# EAGLE design PCB-SSB-2x1 (EAGLE 7.5.0)
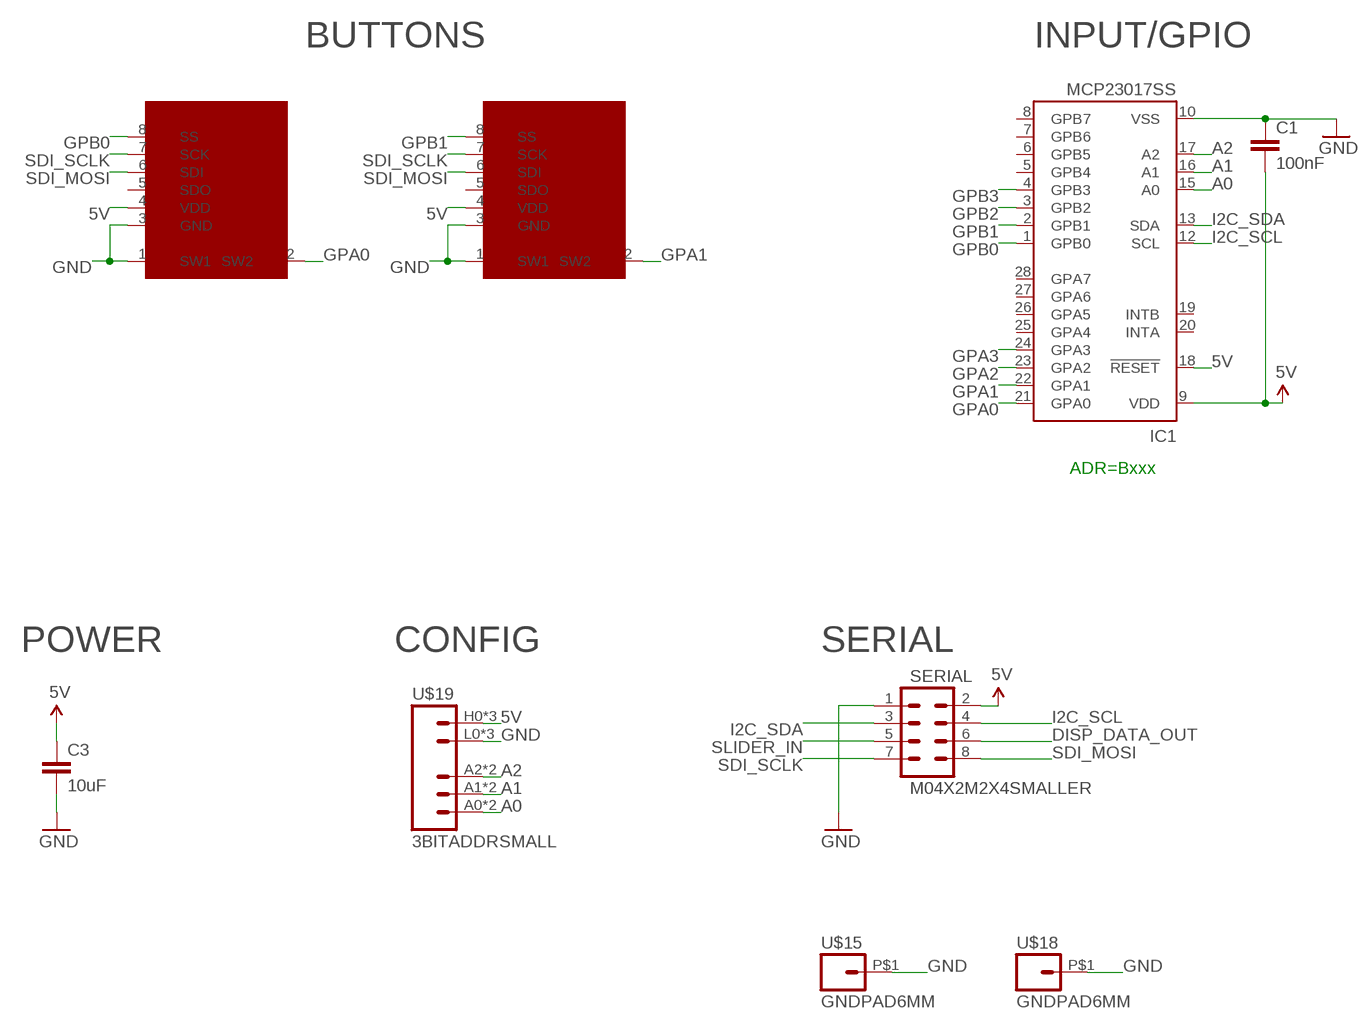
[diagram p0: schematic, sheet 1]

## Parts
C1  100nF  CAP0603-CAP  [0603-CAP]
C3  10uF  CAP0805  [0805]
IC1  MCP23017SS  [SSOP28]
SERIAL  M04X2M2X4SMALLER  [M2X4SMALLER]
SSW1  SMART_SWITCHSMART_SWITCH_8PIN  [SMART_SWITCH]
SSW2  SMART_SWITCHSMART_SWITCH_8PIN  [SMART_SWITCH]
U$15  GNDPAD6MM  [3.2MMPAD6MM]
U$18  GNDPAD6MM  [3.2MMPAD6MM]
U$19  3BITADDRSMALL  [3BITADDR_SMALL]

## Nets
5V [Power]: C1.2 C3.1 IC1.9(VDD) IC1.18(!RESET) SERIAL.2 SSW1.4(VDD) SSW2.4(VDD) U$19.H0(VCC) U$19.H1(VCC) U$19.H2(VCC)
A0: IC1.15(A0) U$19.A0 U$19.AS0(A0)
A1: IC1.16(A1) U$19.A1 U$19.AS1(A1)
A2: IC1.17(A2) U$19.A2 U$19.AS2(A2)
DISP_DATA_OUT: SERIAL.6
GND [Power]: C1.1 C3.2 IC1.10(VSS) SERIAL.1 SSW1.1(SW1) SSW1.3(GND) SSW2.1(SW1) SSW2.3(GND) U$15.P$1 U$18.P$1 U$19.L0(GND) U$19.L1(GND) U$19.L2(GND)
GPA0: IC1.21(GPA0) SSW1.2(SW2)
GPA1: IC1.22(GPA1) SSW2.2(SW2)
GPA2: IC1.23(GPA2)
GPA3: IC1.24(GPA3)
GPB0: IC1.1(GPB0) SSW1.8(SS)
GPB1: IC1.2(GPB1) SSW2.8(SS)
GPB2: IC1.3(GPB2)
GPB3: IC1.4(GPB3)
I2C_SCL: IC1.12(SCL) SERIAL.4
I2C_SDA: IC1.13(SDA) SERIAL.3
SDI_MOSI: SERIAL.8 SSW1.6(SDI) SSW2.6(SDI)
SDI_SCLK: SERIAL.7 SSW1.7(SCK) SSW2.7(SCK)
SLIDER_IN: SERIAL.5
Unconnected: IC1.5(GPB4) IC1.6(GPB5) IC1.7(GPB6) IC1.8(GPB7) IC1.19(INTB) IC1.20(INTA) IC1.25(GPA4) IC1.26(GPA5) IC1.27(GPA6) IC1.28(GPA7) SSW1.5(SDO) SSW2.5(SDO)

## Notes on the sheet
- BUTTONS | INPUT/GPIO
- ADR=Bxxx
- POWER | CONFIG | SERIAL

## Library data of the parts
C1 C3 = SparkFun:CAP: Capacitor Standard 0603 ceramic capacitor, and 0.1" leaded capacitor.
IC1 = microchip:MCP23017: http://ww1.microchip.com/downloads/en/DeviceDoc/21952a.pdf Source: http://ww1.microchip.com/downloads/en/DeviceDoc/21952a.pdf; MF: MICROCHIP; MPN: MCP23017-E/SS; OC_FARNELL: 1467674; OC_NEWARK: 31K2960
SERIAL = SKAARHOJ:M04X2
SSW1 SSW2 = SKAARHOJ:SMART_SWITCH: SMARTSWITCH IS15DSBFP4RGB www.nkksmartswitch.com
U$15 U$18 = SKAARHOJ:GNDPAD
U$19 = SKAARHOJ:3BITADDR

## Net classes
0 default: width 0.203 mm, drill 0.406 mm, clearance 0.203 mm
1 Power: width 0.406 mm, drill 0.61 mm, clearance 0.203 mm

## Board
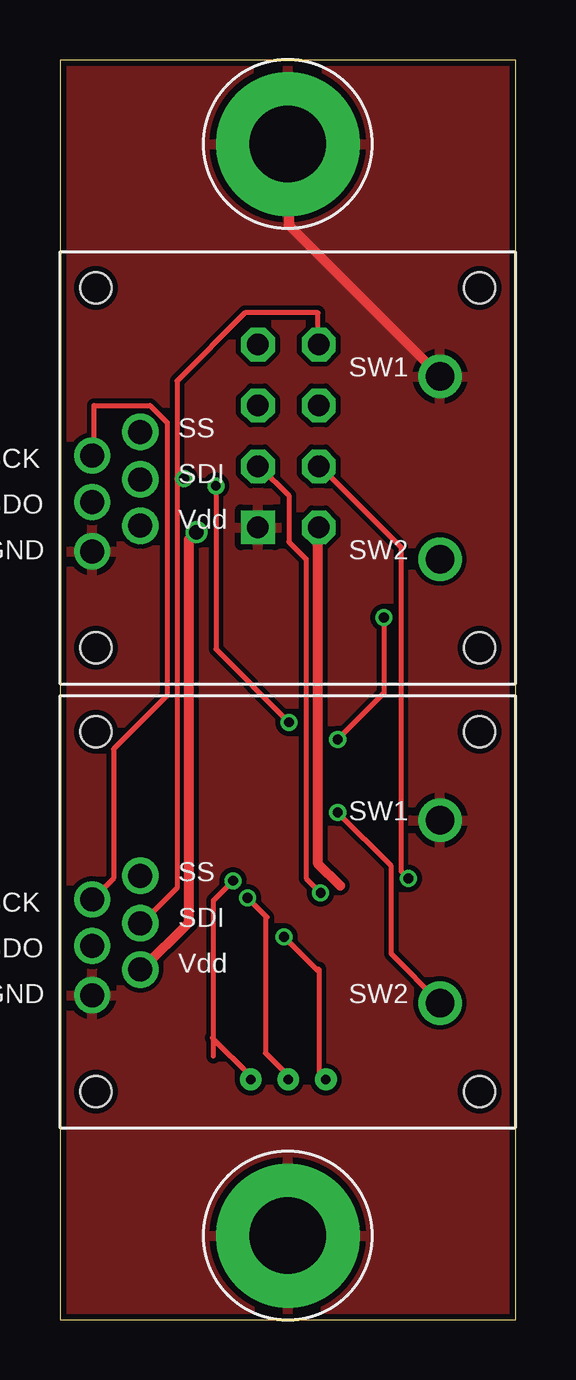
[diagram p1: board, top side]
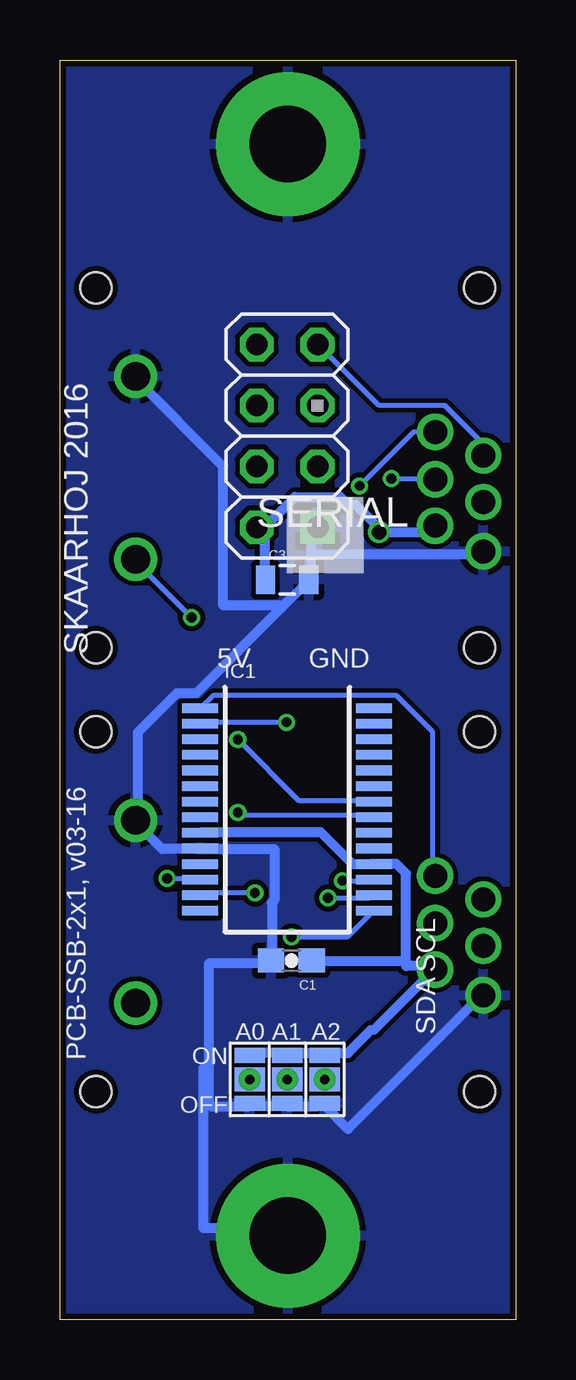
[diagram p2: board, bottom side, seen from below]

Size 19 x 52.5 mm. Coordinates in mm from the lower left corner, seen from the top.
Outline: 0,0 19,0 19,52.5 0,52.5 0,0
Copper layers (1*16): Top 0.035mm / dielectric 1.5mm / Bottom 0.035mm
Design rules "Fusion_eagle_rule_v1.1": minimum track width 6mil, minimum drill 12mil, track to track 6mil, track to pad 6mil, pad to pad 6mil, via to via 6mil, smd to smd 0mil, copper to edge 10mil, drill to drill 10mil, minimum pad ring 10mil, minimum via ring 6mil, stop-mask expansion 2mil, vias tented up to drill 100mil, thermal gap 10mil

### Footprints (pad centres in the part's own frame; a part is rotated, then mirrored left to right if it is on the bottom)
0603-CAP = smd 1.1 x 1: 1 -0.85,0; 2 0.85,0
0805 = smd 0.8 x 1.2: 1 -0.9,0; 2 0.9,0
SSOP28 = smd 0.4 x 1.5: 1 -4.225,-3.625; 2 -3.575,-3.625; 3 -2.925,-3.625; 4 -2.275,-3.625; 5 -1.625,-3.625; 6 -0.975,-3.625; 7 -0.325,-3.625; 8 0.325,-3.625; 9 0.975,-3.625; 10 1.625,-3.625; 11 2.275,-3.625; 12 2.925,-3.625; 13 3.575,-3.625; 14 4.225,-3.625; 15 4.225,3.625; 16 3.575,3.625; 17 2.925,3.625; 18 2.275,3.625; 19 1.625,3.625; 20 0.975,3.625; 21 0.325,3.625; 22 -0.325,3.625; 23 -0.975,3.625; 24 -1.625,3.625; 25 -2.275,3.625; 26 -2.925,3.625; 27 -3.575,3.625; 28 -4.225,3.625
M2X4SMALLER = drill 0.9 square: 1 -1.27,3.81 | drill 0.9 octagon: 2 1.27,3.81; 3 -1.27,1.27; 4 1.27,1.27; 5 -1.27,-1.27; 6 1.27,-1.27; 7 -1.27,-3.81; 8 1.27,-3.81
SMART_SWITCH = drill 1.2: 1 6.35,3.81; 2 6.35,-3.81 | drill 1: 3 -8.153,-3.48; 4 -6.147,-2.413; 5 -8.153,-1.422; 6 -6.147,-0.483; 7 -8.153,0.508; 8 -6.147,1.499 | hole 1.3: -8.001,7.506; 8.001,7.506; 8.001,-7.506; -8.001,-7.506
3.2MMPAD6MM = drill 3.2 pad 6: P$1 0,0
3BITADDR_SMALL = drill 0.4: A0 -1.565,0; A1 0,0; A2 1.565,0 | smd 1.27 x 1: AS0 -1.565,0; AS1 0,0; AS2 1.565,0 | smd 1.27 x 0.635: H0 -1.565,1; H1 0,1; H2 1.565,1; L0 -1.565,-1; L1 0,-1; L2 1.565,-1

### Placement (x,y rotation side)
C1  9.35,14.96 0 bottom
C3  9.53,30.84 0 bottom
IC1  9.53,21.26 270 bottom
SERIAL  9.53,36.83 180 bottom
SSW1  9.5,17 0 top
SSW2  9.5,35.5 0 top
U$15  9.5,3.5 0 top
U$18  9.5,49 0 top
U$19  9.53,10.01 0 bottom

### Tracks (layer width: path | path; a pad name or v marks a point on that pad's centre or on a via)
5V  (via drill 0.61)
  Top 0.406: v5.69,32.82 5.38,32.51 5.38,16.56 3.45,14.63 SSW1.4 | 11.68,18.09 10.77,19 10.77,33.02 SERIAL.2
  Bottom 0.406: IC1.9 13.11,20.32 8.13,20.32 6.81,19 5.99,19 IC1.18 5.79,19 4.98,19 4.57,18.59 4.57,14.92 | 10.48,33.02 10.46,33.02 10.46,30.89 C3.1 | 8.53,14.94 C1.2 8.26,14.92 4.57,14.92 | SSW2.4 3.45,33.02 3.66,32.82 v5.69,32.82 5.71,33.02 6.67,33.97 6.99,33.97 7.3,34.29 9.21,34.29 10.48,33.02 | 4.57,14.92 4.57,14.73 3.45,14.73 SSW1.4 3.45,14.53 5.89,12.09 6.03,12.06 6.99,11.11 7.94,11.11 U$19.H2 8.26,11.11 9.53,11.11 | 9.53,11.11 10.79,11.11 U$19.H0 | 9.53,11.11 U$19.H1 | 10.48,33.02 SERIAL.2
A0  (via drill 0.41)
  Top 0.203: 10.77,14.53 10.74,14.55 | 10.74,14.55 v9.35,15.95 | U$19.AS0 10.79,10.16 10.79,14.61 10.74,14.55
  Bottom 0.203: v9.35,15.95 7.01,15.95 5.99,16.97 IC1.15 | 11.11,10.16 U$19.AS0
A1  (via drill 0.41)
  Top 0.203: 8.64,16.76 8.57,16.83 | 8.57,16.83 v7.82,17.58 | 8.57,16.83 8.57,11.11 9.53,10.16 U$19.AS1
  Bottom 0.203: v7.82,17.58 6.1,17.58 5.99,17.68 IC1.16 | 9.53,10.16 U$19.AS1
A2  (via drill 0.41)
  Top 0.203: v7.21,18.29 6.4,17.48 6.4,11.75 | 6.4,10.97 6.4,11.75 | U$19.AS2 7.94,10.16 6.35,11.75 6.4,11.75
  Bottom 0.203: v7.21,18.29 5.99,18.29 IC1.17 | 8.26,10.16 U$19.AS2
GND
  Top 0.406: 9.55,3.56 U$15.P$1 | SSW2.1 9.55,45.62 9.55,48.97 U$18.P$1
  Bottom 0.406: SSW1.3 1.42,13.51 6.91,8.03 6.99,7.94 7.94,8.89 U$19.L2 8.26,8.89 9.53,8.89 | 8.53,31.9 8.53,33.02 SERIAL.1 | 8.53,31.9 8.53,30.89 C3.2 8.74,30.68 9.75,29.67 | 8.53,31.9 1.52,31.9 1.42,32 SSW2.3 | 9.75,29.67 13.31,26.11 14.12,26.11 15.75,24.49 15.75,20.93 SSW1.1 15.85,20.73 14.73,19.61 13.31,19.61 IC1.10 13.11,19.61 10.06,19.61 10.06,17.48 10.16,17.37 10.16,15.04 C1.1 10.36,14.83 12.8,14.83 12.8,10.79 | SSW2.1 15.85,39.22 12.19,35.56 12.19,29.77 9.86,29.77 9.75,29.67 | 12.8,10.79 12.8,9.04 12.7,8.89 11.11,8.89 U$19.L0 10.79,8.89 9.53,8.89 | 9.53,8.89 U$19.L1 | 12.8,10.79 12.7,10.79 13.02,10.48 13.02,3.81 9.53,3.81 U$15.P$1
  pour Top: 0,0 19.05,0 19.05,52.07 0,52.07
  pour Bottom: 0,0 19.05,0 19.05,52.07 0,52.07
GPA0  (via drill 0.41)
  Top 0.203: v11.58,21.13 13.82,18.9 13.82,15.24 15.85,13.21 SSW1.2
  Bottom 0.203: v11.58,21.13 11.48,21.03 5.99,21.03 IC1.21
GPA1  (via drill 0.41)
  Top 0.203: v11.58,24.18 13.51,26.11 v13.51,29.26
  Bottom 0.203: v11.58,24.18 9.04,21.64 5.99,21.64 IC1.22 | v13.51,29.26 15.85,31.6 SSW2.2
GPB0
  Bottom 0.203: IC1.1 13.11,25.5 12.6,26.01 4.98,26.01 3.45,24.49 3.45,18.59 SSW1.8
GPB1  (via drill 0.41)
  Top 0.203: v9.55,24.89 6.5,27.94 v6.5,34.75
  Bottom 0.203: v9.55,24.89 13.11,24.89 IC1.2 | v6.5,34.75 4.27,36.98 3.45,36.98 SSW2.8
I2C_SCL  (via drill 0.41)
  Top 0.203: v14.53,18.39 14.22,18.69 14.22,32.21 10.87,35.56 SERIAL.4
  Bottom 0.203: v14.53,18.39 13.21,18.39 IC1.12
I2C_SDA  (via drill 0.41)
  Top 0.203: v10.87,17.78 10.26,18.39 10.26,31.7 9.55,32.41 9.55,34.34 8.33,35.56 SERIAL.3
  Bottom 0.203: v10.87,17.78 13.11,17.78 IC1.13
SDI_MOSI  (via drill 0.41)
  Top 0.203: 4.88,35.05 4.88,39.12 7.72,41.96 10.77,41.96 10.77,40.64 SERIAL.8 | 4.88,35.05 4.88,17.98 3.45,16.56 SSW1.6 | 4.88,35.05 v5.18,35.05
  Bottom 0.203: v5.18,35.05 3.45,35.05 SSW2.6
SDI_SCLK
  Top 0.203: SSW1.7 1.42,17.58 2.23,18.39 2.23,23.77 4.47,26.01 4.47,37.39 3.76,38.1 1.42,38.1 1.42,36.07 SSW2.7
  Bottom 0.203: SERIAL.7 8.23,40.64 5.69,38.1 2.95,38.1 1.42,36.58 1.42,36.07 SSW2.7

### Text on the board
_bsilk: SKAARHOJ 2016 | GND | 5V | PCB-SSB-2x1, v03-16 | SCL | SDA